# EAGLE design new_PowerBoard_V3 (EAGLE 5.11)
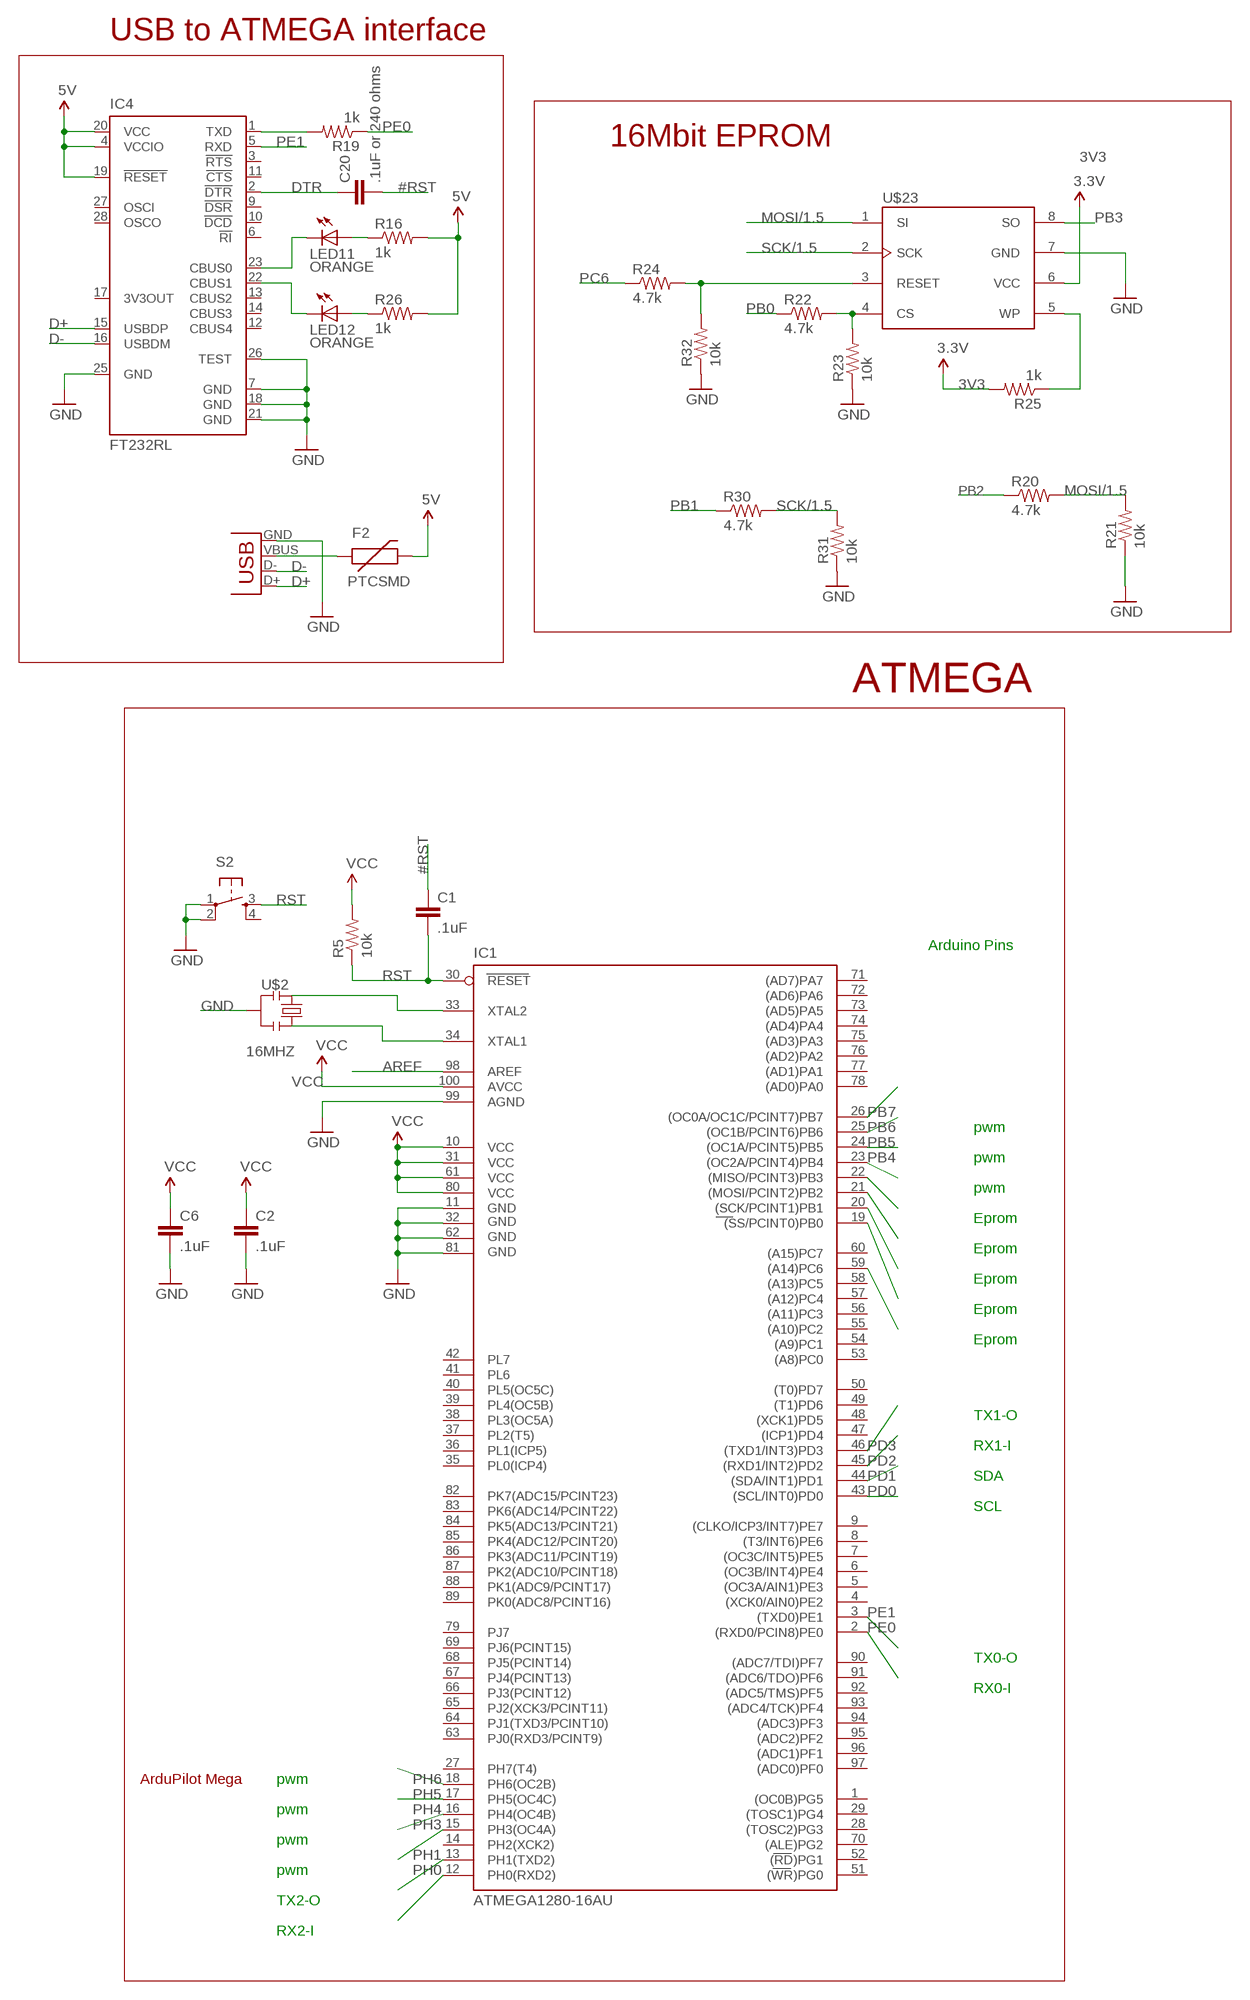
[diagram p0: schematic, sheet 1, part 1 of 2]
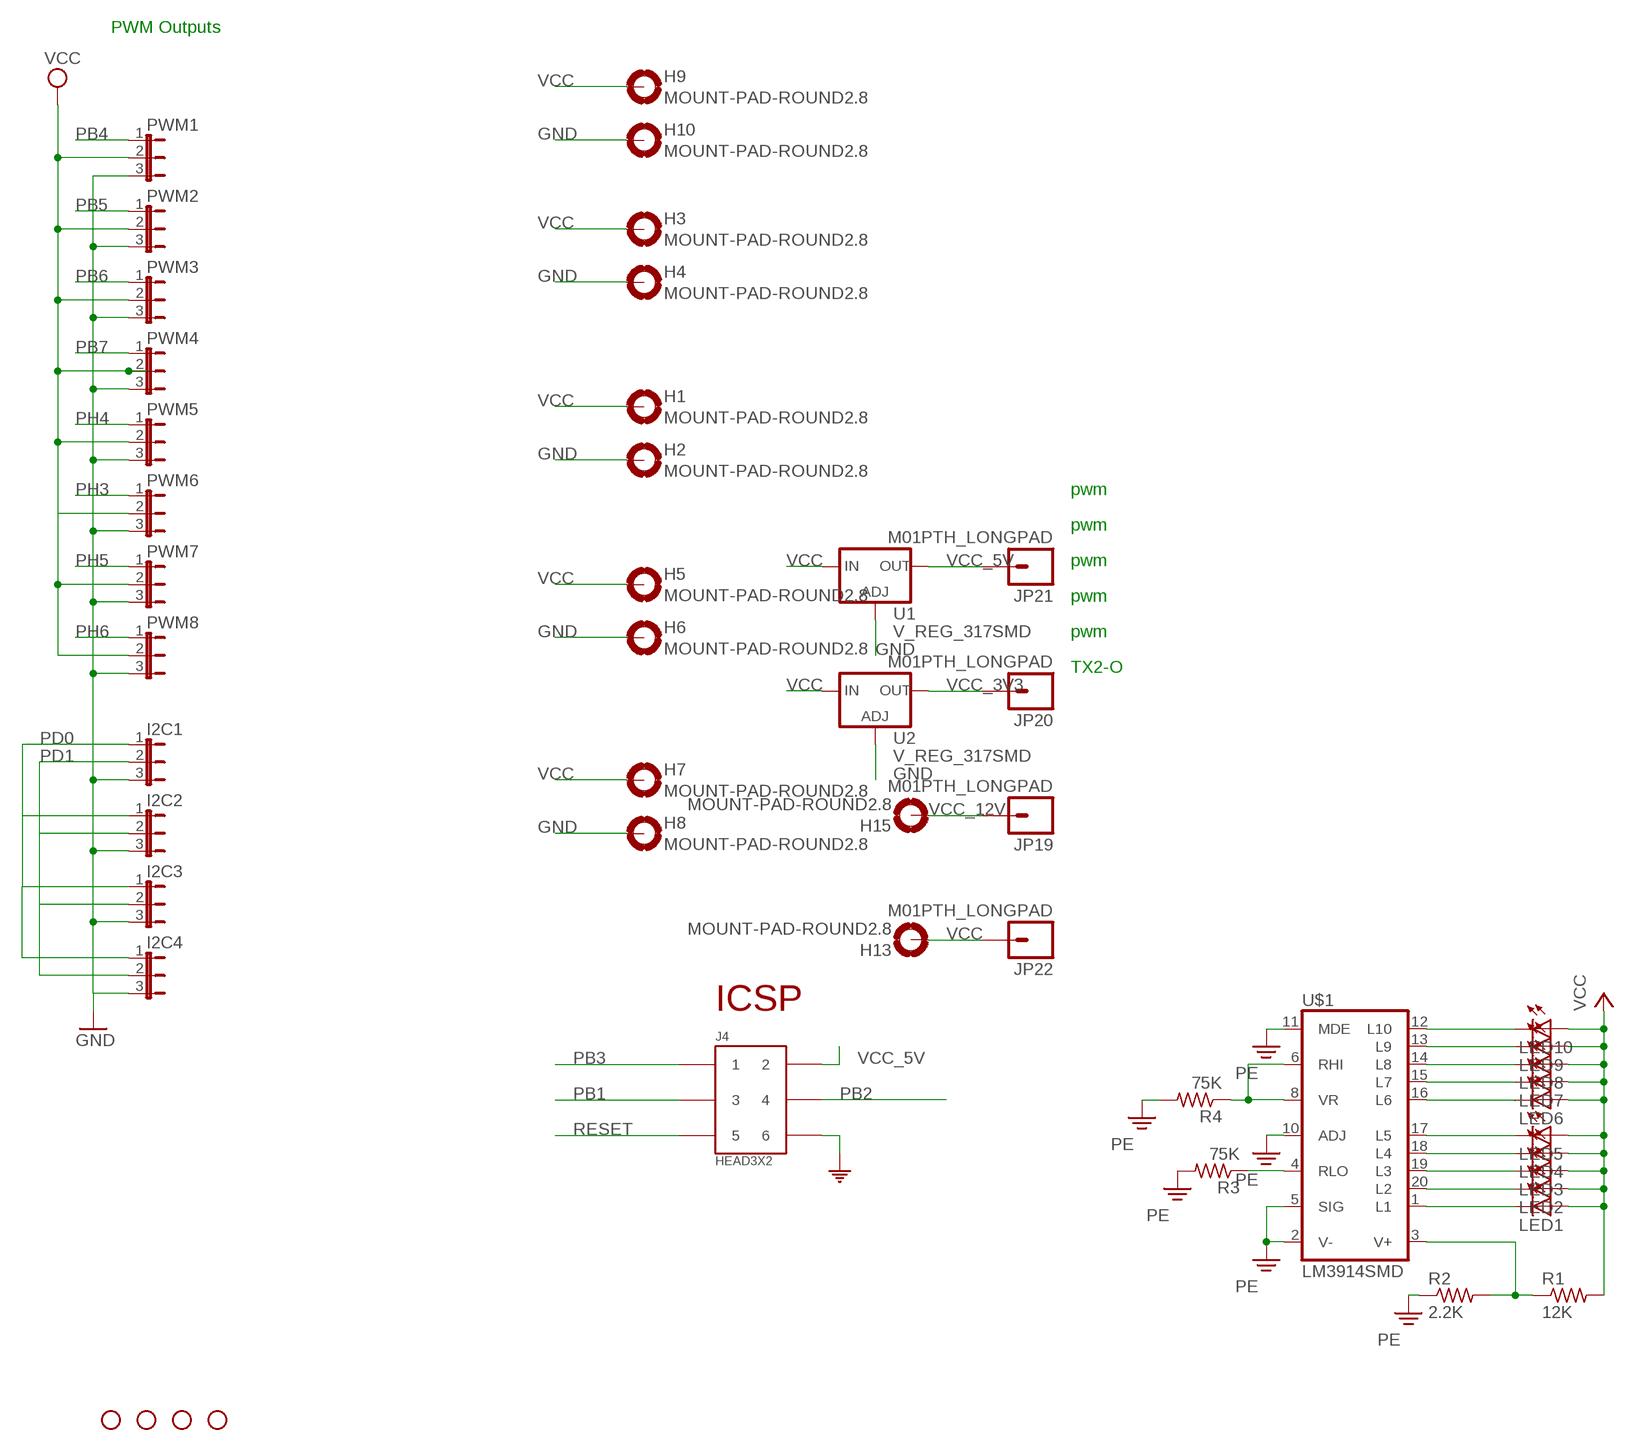
[diagram p1: schematic, sheet 1, part 2 of 2]

## Parts
C1  .1uF  CAP0402  [C0402]
C2  .1uF  CAP0402  [C0402]
C6  .1uF  CAP0402  [C0402]
C20  .1uF or 240 ohms  CAP0402  [C0402]
F2  PTCSMD  [PTC-1206]
H1  MOUNT-PAD-ROUND2.8  [2,8-PAD]
H2  MOUNT-PAD-ROUND2.8  [2,8-PAD]
H3  MOUNT-PAD-ROUND2.8  [2,8-PAD]
H4  MOUNT-PAD-ROUND2.8  [2,8-PAD]
H5  MOUNT-PAD-ROUND2.8  [2,8-PAD]
H6  MOUNT-PAD-ROUND2.8  [2,8-PAD]
H7  MOUNT-PAD-ROUND2.8  [2,8-PAD]
H8  MOUNT-PAD-ROUND2.8  [2,8-PAD]
H9  MOUNT-PAD-ROUND2.8  [2,8-PAD]
H10  MOUNT-PAD-ROUND2.8  [2,8-PAD]
H13  MOUNT-PAD-ROUND2.8  [2,8-PAD]
H15  MOUNT-PAD-ROUND2.8  [2,8-PAD]
I2C1  JP2E  [JP2]
I2C2  JP2E  [JP2]
I2C3  JP2E  [JP2]
I2C4  JP2E  [JP2]
IC1  ATMEGA1280-16AU  [TQFP100]
IC4  FT232RL  [SSOP28]
J4  HEAD3X2  [HEAD3X2]
JP12  STAND-OFF  [STAND-OFF]
JP13  STAND-OFF  [STAND-OFF]
JP14  STAND-OFF  [STAND-OFF]
JP15  STAND-OFF  [STAND-OFF]
JP19  M01PTH_LONGPAD  [1X01_LONGPAD]
JP20  M01PTH_LONGPAD  [1X01_LONGPAD]
JP21  M01PTH_LONGPAD  [1X01_LONGPAD]
JP22  M01PTH_LONGPAD  [1X01_LONGPAD]
LED1  LEDSMT1206  [1206]
LED2  LEDSMT1206  [1206]
LED3  LEDSMT1206  [1206]
LED4  LEDSMT1206  [1206]
LED5  LEDSMT1206  [1206]
LED6  LEDSMT1206  [1206]
LED7  LEDSMT1206  [1206]
LED8  LEDSMT1206  [1206]
LED9  LEDSMT1206  [1206]
LED10  LEDSMT1206  [1206]
LED11  ORANGE  LED0603  [LED-0603]
LED12  ORANGE  LED0603  [LED-0603]
PWM1  JP2E  [JP2]
PWM2  JP2E  [JP2]
PWM3  JP2E  [JP2]
PWM4  JP2E  [JP2]
PWM5  JP2E  [JP2]
PWM6  JP2E  [JP2]
PWM7  JP2E  [JP2]
PWM8  JP2E  [JP2]
R1  12K  R-US_R0805  [R0805]
R2  2.2K  R-US_R0805  [R0805]
R3  75K  R-US_R0805  [R0805]
R4  75K  R-US_R0805  [R0805]
R5  10k  RESISTOR0402  [C0402]
R16  1k  RESISTOR0402  [C0402]
R19  1k  RESISTOR0402  [C0402]
R20  4.7k  RESISTOR0402  [C0402]
R21  10k  RESISTOR0402  [C0402]
R22  4.7k  RESISTOR0402  [C0402]
R23  10k  RESISTOR0402  [C0402]
R24  4.7k  RESISTOR0402  [C0402]
R25  1k  RESISTOR0402  [C0402]
R26  1k  RESISTOR0402  [C0402]
R30  4.7k  RESISTOR0402  [C0402]
R31  10k  RESISTOR0402  [C0402]
R32  10k  RESISTOR0402  [C0402]
S2  TAC_SWITCHSMD  [TACTILE_SWITCH_SMD]
U1  V_REG_317SMD  [SOT223]
U2  V_REG_317SMD  [SOT223]
U$1  LM3914SMD  [PLCC20S]
U$2  16MHZ  RESONATORSMD  [RESONATOR-SMD]
U$23  DF  ATMEL_DATA_FLASH  [SO08WIDE]
X1  USBSMD  [USB-MINIB]

## Nets
3V3: R25.2 U$23.6(VCC) ; supply symbol labelled 3.3V
5V: F2.2
#RST: C1.1 C20.2
AREF: IC1.98(AREF)
D+: IC4.15(USBDP) X1.D+
D-: IC4.16(USBDM) X1.D-
DTR: C20.1 IC4.2(!DTR)
GND: C2.2 C6.2 H2.B2,8(MOUNT) H4.B2,8(MOUNT) H6.B2,8(MOUNT) H8.B2,8(MOUNT) H10.B2,8(MOUNT) I2C1.3 I2C2.3 I2C3.3 I2C4.3 IC1.11(GND) IC1.32(GND1) IC1.62(GND2) IC1.81(GND3) IC1.99(AGND) IC4.7(GND) IC4.18(GND) IC4.21(GND) IC4.25(GND) IC4.26(TEST) J4.6 PWM1.3 PWM2.3 PWM3.3 PWM4.3 PWM5.3 PWM6.3 PWM7.3 PWM8.3 R21.1 R23.1 R31.1 R32.1 S2.1 S2.2 U1.1(ADJ) U2.1(ADJ) U$2.2 U$23.7(GND) X1.GND ; supply symbol labelled COM
MOSI/1.5: R20.2 R21.2 U$23.1(SI)
N$1: R1.1 R2.2 U$1.3(V+)
N$2: LED10.C U$1.12(L10)
N$3: LED9.C U$1.13(L9)
N$4: LED8.C U$1.14(L8)
N$5: LED7.C U$1.15(L7)
N$7: LED6.C U$1.16(L6)
N$8: LED5.C U$1.17(L5)
N$9: LED4.C U$1.18(L4)
N$10: LED3.C U$1.19(L3)
N$11: LED2.C U$1.20(L2)
N$12: LED1.C U$1.1(L1)
N$14: R3.1 U$1.4(RLO)
N$15: R4.1 U$1.6(RHI) U$1.8(VR)
N$17: LED11.A R16.1
N$18: IC4.1(TXD) R19.2
N$19: R22.2 R23.2 U$23.4(CS)
N$20: R24.2 R32.2 U$23.3(RESET)
N$21: F2.1 X1.VBUS
N$22: LED12.A R26.1
N$24: IC4.23(CBUS0) LED11.C
N$25: IC4.22(CBUS1) LED12.C
N$56: IC1.34(XTAL1) U$2.3
N$89: IC1.33(XTAL2) U$2.1
PB0: IC1.19((SS/PCINT0)PB0) R22.1
PB1: IC1.20((SCK/PCINT1)PB1) J4.3 R30.1
PB2: IC1.21((MOSI/PCINT2)PB2) J4.4 R20.1
PB3: IC1.22((MISO/PCINT3)PB3) J4.1 U$23.8(SO)
PB4: IC1.23((OC2A/PCINT4)PB4) PWM1.1
PB5: IC1.24((OC1A/PCINT5)PB5) PWM2.1
PB6: IC1.25((OC1B/PCINT6)PB6) PWM3.1
PB7: IC1.26((OC0A/OC1C/PCINT7)PB7) PWM4.1
PC6: IC1.59((A14)PC6) R24.1
PD0: I2C1.1 I2C2.1 I2C3.1 I2C4.1 IC1.43((SCL/INT0)PD0)
PD1: I2C1.2 I2C2.2 I2C3.2 I2C4.2 IC1.44((SDA/INT1)PD1)
PD2: IC1.45((RXD1/INT2)PD2)
PD3: IC1.46((TXD1/INT3)PD3)
PE: R2.1 R3.2 R4.2 U$1.2(V-) U$1.5(SIG) U$1.10(ADJ) U$1.11(MDE)
PE0: IC1.2((RXD0/PCIN8)PE0) R19.1
PE1: IC1.3((TXD0)PE1) IC4.5(RXD)
PH0: IC1.12(PH0(RXD2))
PH1: IC1.13(PH1(TXD2))
PH3: IC1.15(PH3(OC4A)) PWM6.1
PH4: IC1.16(PH4(OC4B)) PWM5.1
PH5: IC1.17(PH5(OC4C)) PWM7.1
PH6: IC1.18(PH6(OC2B)) PWM8.1
RESET: J4.5
RST: C1.2 IC1.30(RESET) R5.1 S2.3
SCK/1.5: R30.2 R31.2 U$23.2(SCK)
VCC: C2.1 C6.1 H1.B2,8(MOUNT) H3.B2,8(MOUNT) H5.B2,8(MOUNT) H7.B2,8(MOUNT) H9.B2,8(MOUNT) H13.B2,8(MOUNT) IC1.10(VCC) IC1.31(VCC1) IC1.61(VCC2) IC1.80(VCC3) IC1.100(AVCC) IC4.4(VCCIO) IC4.19(!RESET) IC4.20(VCC) JP22.1 LED1.A LED2.A LED3.A LED4.A LED5.A LED6.A LED7.A LED8.A LED9.A LED10.A PWM7.2 PWM8.2 R1.2 R5.2 R16.2 R26.2 U1.3(IN) U2.3(IN) ; supply symbol labelled 5V
VCC_3V3: JP20.1 U2.2(OUT)
VCC_5V: J4.2 JP21.1 PWM1.2 PWM2.2 PWM3.2 PWM4.2 PWM5.2 PWM6.2 U1.2(OUT) ; supply symbol labelled VCC
VCC_12V: H15.B2,8(MOUNT) JP19.1
WP: R25.1 U$23.5(WP)
Unconnected: IC1.1((OC0B)PG5) IC1.4((XCK0/AIN0)PE2) IC1.5((OC3A/AIN1)PE3) IC1.6((OC3B/INT4)PE4) IC1.7((OC3C/INT5)PE5) IC1.8((T3/INT6)PE6) IC1.9((CLKO/ICP3/INT7)PE7) IC1.14(PH2(XCK2)) IC1.27(PH7(T4)) IC1.28((TOSC2)PG3) IC1.29((TOSC1)PG4) IC1.35(PL0(ICP4)) IC1.36(PL1(ICP5)) IC1.37(PL2(T5)) IC1.38(PL3(OC5A)) IC1.39(PL4(OC5B)) IC1.40(PL5(OC5C)) IC1.41(PL6) IC1.42(PL7) IC1.47((ICP1)PD4) IC1.48((XCK1)PD5) IC1.49((T1)PD6) IC1.50((T0)PD7) IC1.51((WR)PG0) IC1.52((RD)PG1) IC1.53((A8)PC0) IC1.54((A9)PC1) IC1.55((A10)PC2) IC1.56((A11)PC3) IC1.57((A12)PC4) IC1.58((A13)PC5) IC1.60((A15)PC7) IC1.63(PJ0(RXD3/PCINT9)) IC1.64(PJ1(TXD3/PCINT10)) IC1.65(PJ2(XCK3/PCINT11)) IC1.66(PJ3(PCINT12)) IC1.67(PJ4(PCINT13)) IC1.68(PJ5(PCINT14)) IC1.69(PJ6(PCINT15)) IC1.70((ALE)PG2) IC1.71((AD7)PA7) IC1.72((AD6)PA6) IC1.73((AD5)PA5) IC1.74((AD4)PA4) IC1.75((AD3)PA3) IC1.76((AD2)PA2) IC1.77((AD1)PA1) IC1.78((AD0)PA0) IC1.79(PJ7) IC1.82(PK7(ADC15/PCINT23)) IC1.83(PK6(ADC14/PCINT22)) IC1.84(PK5(ADC13/PCINT21)) IC1.85(PK4(ADC12/PCINT20)) IC1.86(PK3(ADC11/PCINT19)) IC1.87(PK2(ADC10/PCINT18)) IC1.88(PK1(ADC9/PCINT17)) IC1.89(PK0(ADC8/PCINT16)) IC1.90((ADC7/TDI)PF7) IC1.91((ADC6/TDO)PF6) IC1.92((ADC5/TMS)PF5) IC1.93((ADC4/TCK)PF4) IC1.94((ADC3)PF3) IC1.95((ADC2)PF2) IC1.96((ADC1)PF1) IC1.97((ADC0)PF0) IC4.3(!RTS) IC4.6(!RI) IC4.9(!DSR) IC4.10(!DCD) IC4.11(!CTS) IC4.12(CBUS4) IC4.13(CBUS2) IC4.14(CBUS3) IC4.17(3V3OUT) IC4.27(OSCI) IC4.28(OSCO) S2.4

## Notes on the sheet
- USB to ATMEGA interface
- 16Mbit EPROM
- PWM Outputs
- ATMEGA
- Arduino Pins
- pwm
- pwm
- pwm
- pwm
- pwm
- pwm
- TX2-O
- pwm
- pwm
- Eprom
- Eprom
- Eprom
- Eprom
- Eprom
- TX1-O
- ICSP
- RX1-I
- SDA
- SCL
- TX0-O
- RX0-I
- ArduPilot Mega | pwm
- pwm
- pwm
- pwm
- TX2-O
- RX2-I

## Library data of the parts
C1 C2 C6 C20 = DIYdrones3:CAP: Capacitor Standard 0603 ceramic capacitor, and 0.1" leaded capacitor.
F2 = DIYdrones3:PTC: Resettable Fuse PTC Resettable Fuse. Spark Fun Electronics SKU : COM-08357
H1-H10 H13 H15 = holes:MOUNT-PAD-ROUND: MOUNTING PAD, round
I2C1-I2C4 PWM1-PWM8 = jumper:JP2E: JUMPER
IC1 = atmel-2010:ATMEGA*: MICROCONTROLLER 64/128/256 Kbytes FLASH 4 Kbytes EEPROM 8 Kbytes SRAM 86 General Purpose I/O pins 12-channels16-bit PWM 4 x Serial USARTs 16-channels 10-bit A/D
IC4 = ftdichip:FT232R: Source: http://www.ftdichip.com/Documents/DataSheets/DS_FT232R_v104.pdf
J4 = MyCON2:HEAD3X2
JP12-JP15 = SparkFun:STAND-OFF: Stand Off This is the mechanical footprint for a #4 phillips button head screw. Use the keepout ring to avoid running the screw head into surrounding components. SKU : PRT-00447
JP19-JP22 = SparkFun:M01: Header 1 Standard 1-pin 0.1" header. Use with straight break away headers (SKU : PRT-00116), right angle break away headers (PRT-00553), swiss pins (PRT-00743), machine pins (PRT-00117), and female headers (PRT-00115).
LED1-LED10 = led:LED: LED OSRAM: - CHIPLED LG R971, LG N971, LY N971, LG Q971, LY Q971, LO R971, LY R971 LH N974, LH R974 LS Q976, LO Q976, LY Q976 LO Q996 - Hyper CHIPLED LW Q18S LB Q993, LB Q99A, LB R99A - SideLED LS A670, LO A670, LY A670, LG A670, LP A670 LB A673, LV A673, LT A673, LW A673 LH A674 LY A675 LS A676, LA A676, LO A676, LY A676, LW A676 LS A679, LY A679, LG A679 - Hyper Micro SIDELED® LS Y876, LA Y876, LO Y876, LY Y876 LT Y87S - SmartLED LW L88C, LW L88S LB L89C, LB L89S, LG L890 LS L89K, LO L89K, LY L89K LS L896, LA L896, LO L896, LY L896 - TOPLED LS T670, LO T670, LY T670, LG T670, LP T670 LSG T670, LSP T670, LSY T670, LOP T670, LYG T670 LG T671, LOG T671, LSG T671 LB T673, LV T673, LT T673, LW T673 LH T674 LS T676, LA T676, LO T676, LY T676, LB T676, LH T676, LSB T676, LW T676 LB T67C, LV T67C, LT T67C, LS T67K, LO T67K, LY T67K, LW E67C LS E67B, LA E67B, LO E67B, LY E67B, LB E67C, LV E67C, LT E67C LW T67C LS T679, LY T679, LG T679 LS T770, LO T770, LY T770, LG T770, LP T770 LB T773, LV T773, LT T773, LW T773 LH T774 LS E675, LA E675, LY E675, LS T675 LS T776, LA T776, LO T776, LY T776, LB T776 LHGB T686 LT T68C, LB T68C - Hyper Mini TOPLED® LB M676 - Mini TOPLED Santana® LG M470 LS M47K, LO M47K, LY M47K Source: http://www.osram.convergy.de LUXEON: - LUMILED® LXK2-PW12-R00, LXK2-PW12-S00, LXK2-PW14-U00, LXK2-PW14-V00 LXK2-PM12-R00, LXK2-PM12-S00, LXK2-PM14-U00 LXK2-PE12-Q00, LXK2-PE12-R00, LXK2-PE12-S00, LXK2-PE14-T00, LXK2-PE14-U00 LXK2-PB12-K00, LXK2-PB12-L00, LXK2-PB12-M00, LXK2-PB14-N00, LXK2-PB14-P00, LXK2-PB14-Q00 LXK2-PR12-L00, LXK2-PR12-M00, LXK2-PR14-Q00, LXK2-PR14-R00 LXK2-PD12-Q00, LXK2-PD12-R00, LXK2-PD12-S00 LXK2-PH12-R00, LXK2-PH12-S00 LXK2-PL12-P00, LXK2-PL12-Q00, LXK2-PL12-R00 Source: www.luxeon.com KINGBRIGHT: KA-3528ASYC Source: www.kingbright.com
LED11 LED12 = DIYdrones3:LED: LEDs Standard schematic elements and footprints for 5mm, 3mm, 1206, and 0603 sized LEDs. 5mm - Spark Fun Electronics SKU : COM-00529 (and others)
R1-R4 = resistor:R-US_: RESISTOR, American symbol
R5 R16 R19-R26 R30-R32 = DIYdrones3:RESISTOR: Resistor Basic schematic elements and footprints for 0603, 1206, and PTH 1/10th watt (small) resistors.
S2 = SparkFun:TAC_SWITCH: Momentary Switch Button commonly used for reset or general input. Spark Fun Electronics SKU : COM-00097
U1 U2 = SparkFun:V_REG_317: Voltage Regulator Standard LM317 adjustable voltage regulator. AOI (Adjust Output Input). Google 'LM317 Calculator' for easy to use app to get the two resistor values needed. 240/720 for 5V output. 240/390 for 3.3V output. Spark Fun Electronics SKU : COM-00527
U$1 = linear:LM3914SMD
U$2 = DIYdrones3:RESONATOR: Resonator Small SMD resonator. This is the itty bitty 10/20MHz resonators with built in caps. CSTCE10M0G55 and CSTCE20M0V53. Footprint has been reviewed closely but hasn't been tested yet.
U$23 = DIYdrones3:ATMEL_DATA_FLASH: 16Mbit EEPROM DataFlash Footprint needs touching up. Spark Fun Electronics SKU : COM-00301
X1 = DIYdrones3:USB: USB Connectors USB-B-PTH is fully proven SKU : PRT-00139 USB-miniB is fully proven SKU : PRT-00587 USB-A-PCB is untested. USB-A-H is throughly reviewed, but untested. Spark Fun Electronics SKU : PRT-00437 USB-B-SMT is throughly reviewed, but untested. Needs silkscreen touching up. USB-A-S has not been used/tested USB-MB-H has not been used/tested

## Board
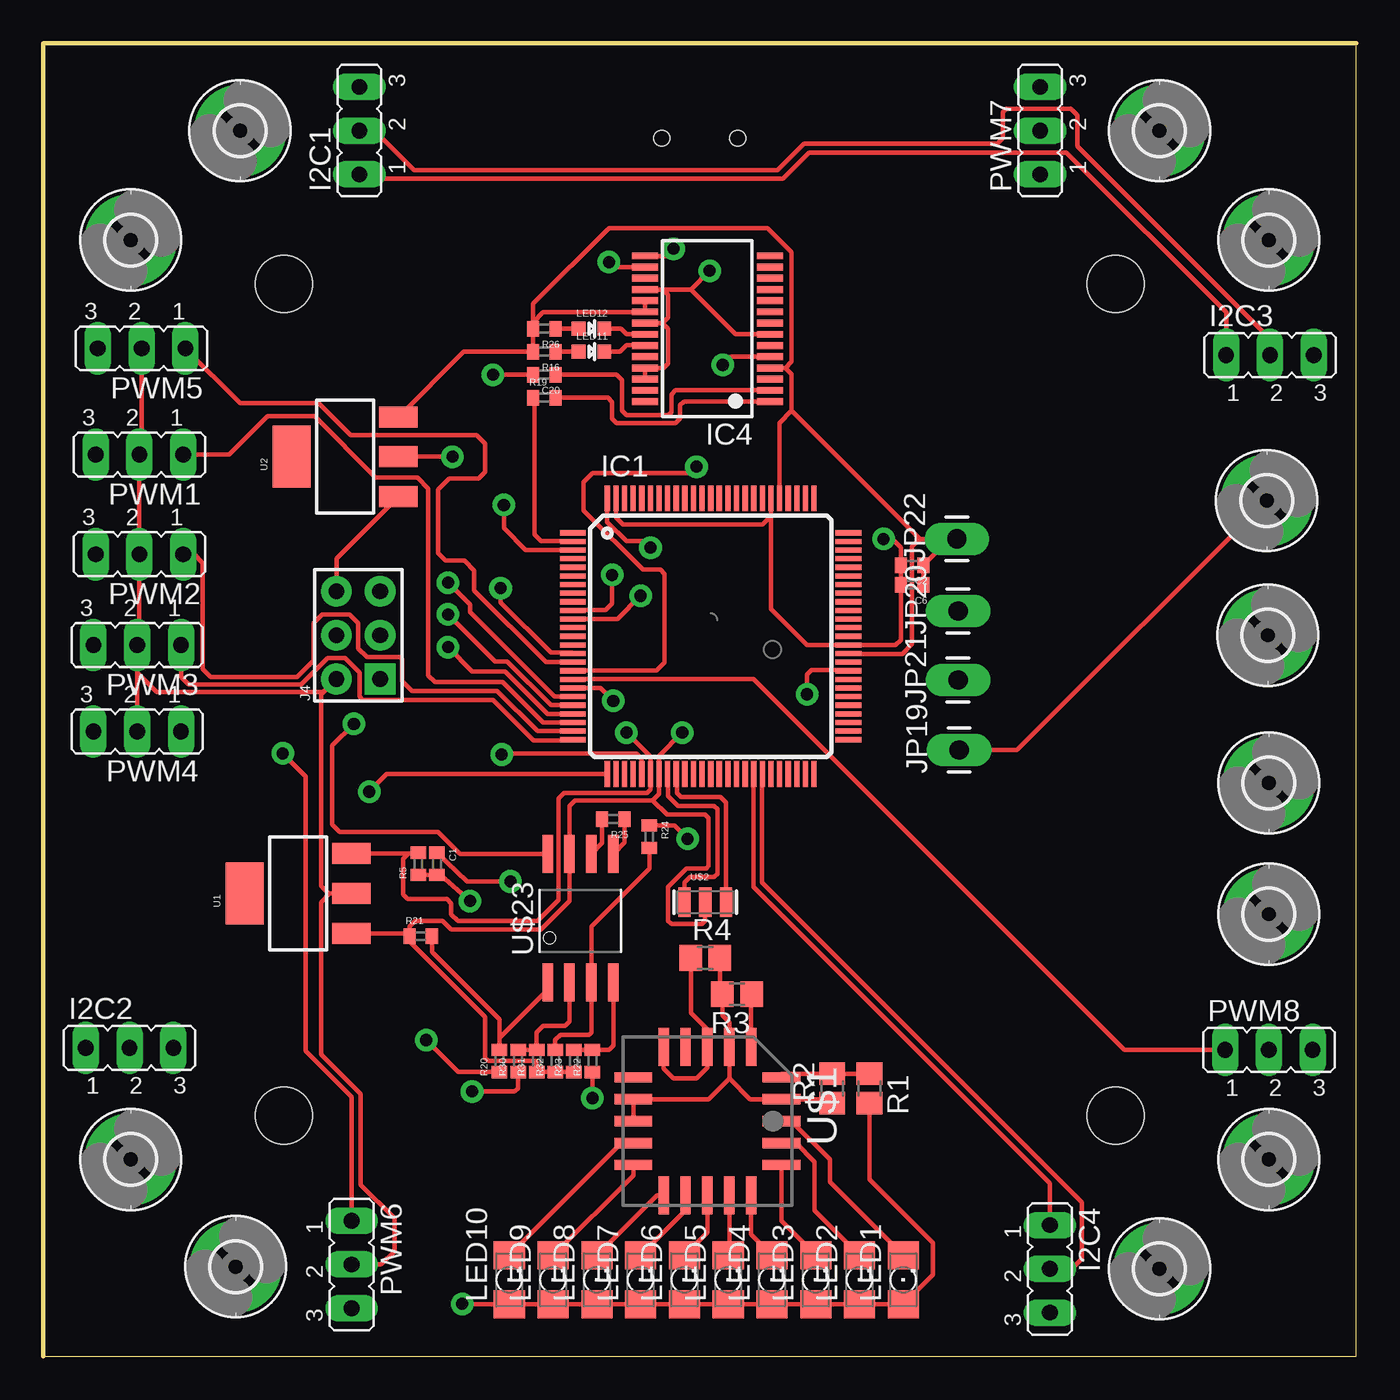
[diagram p2: board, top side]
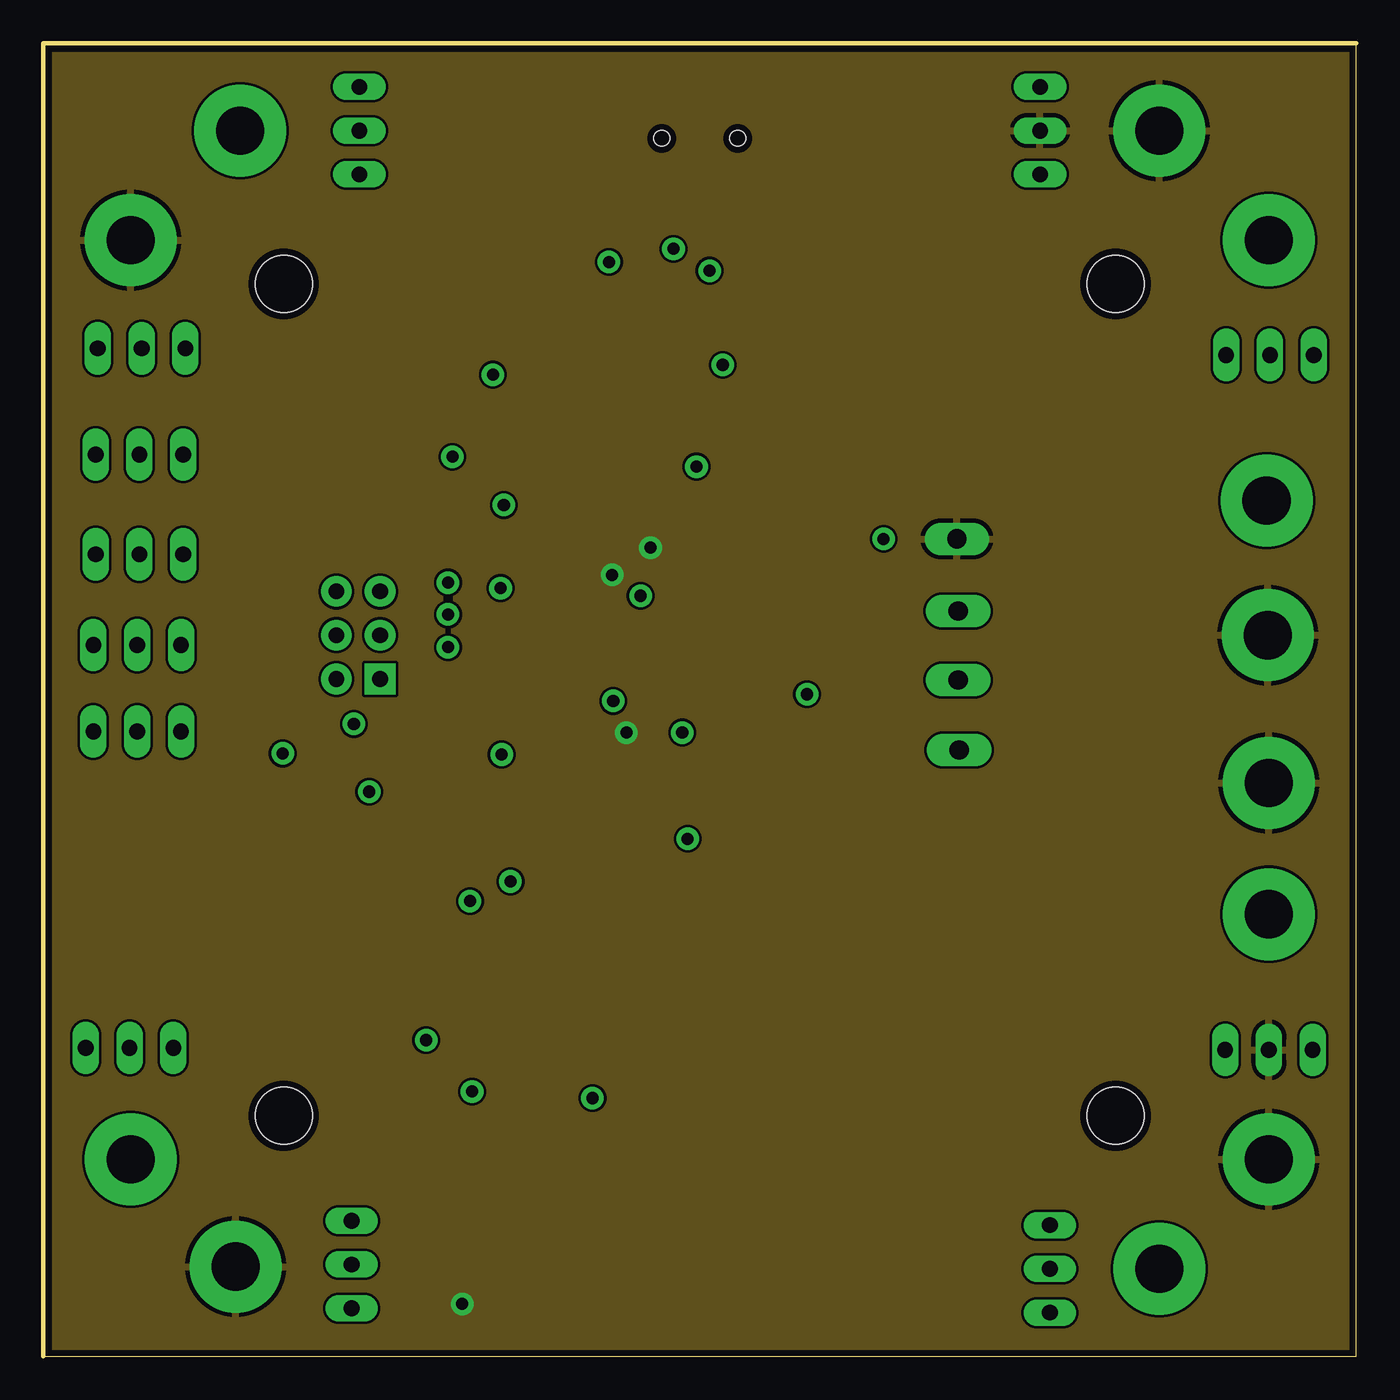
[diagram p3: board, inner layer VCC]
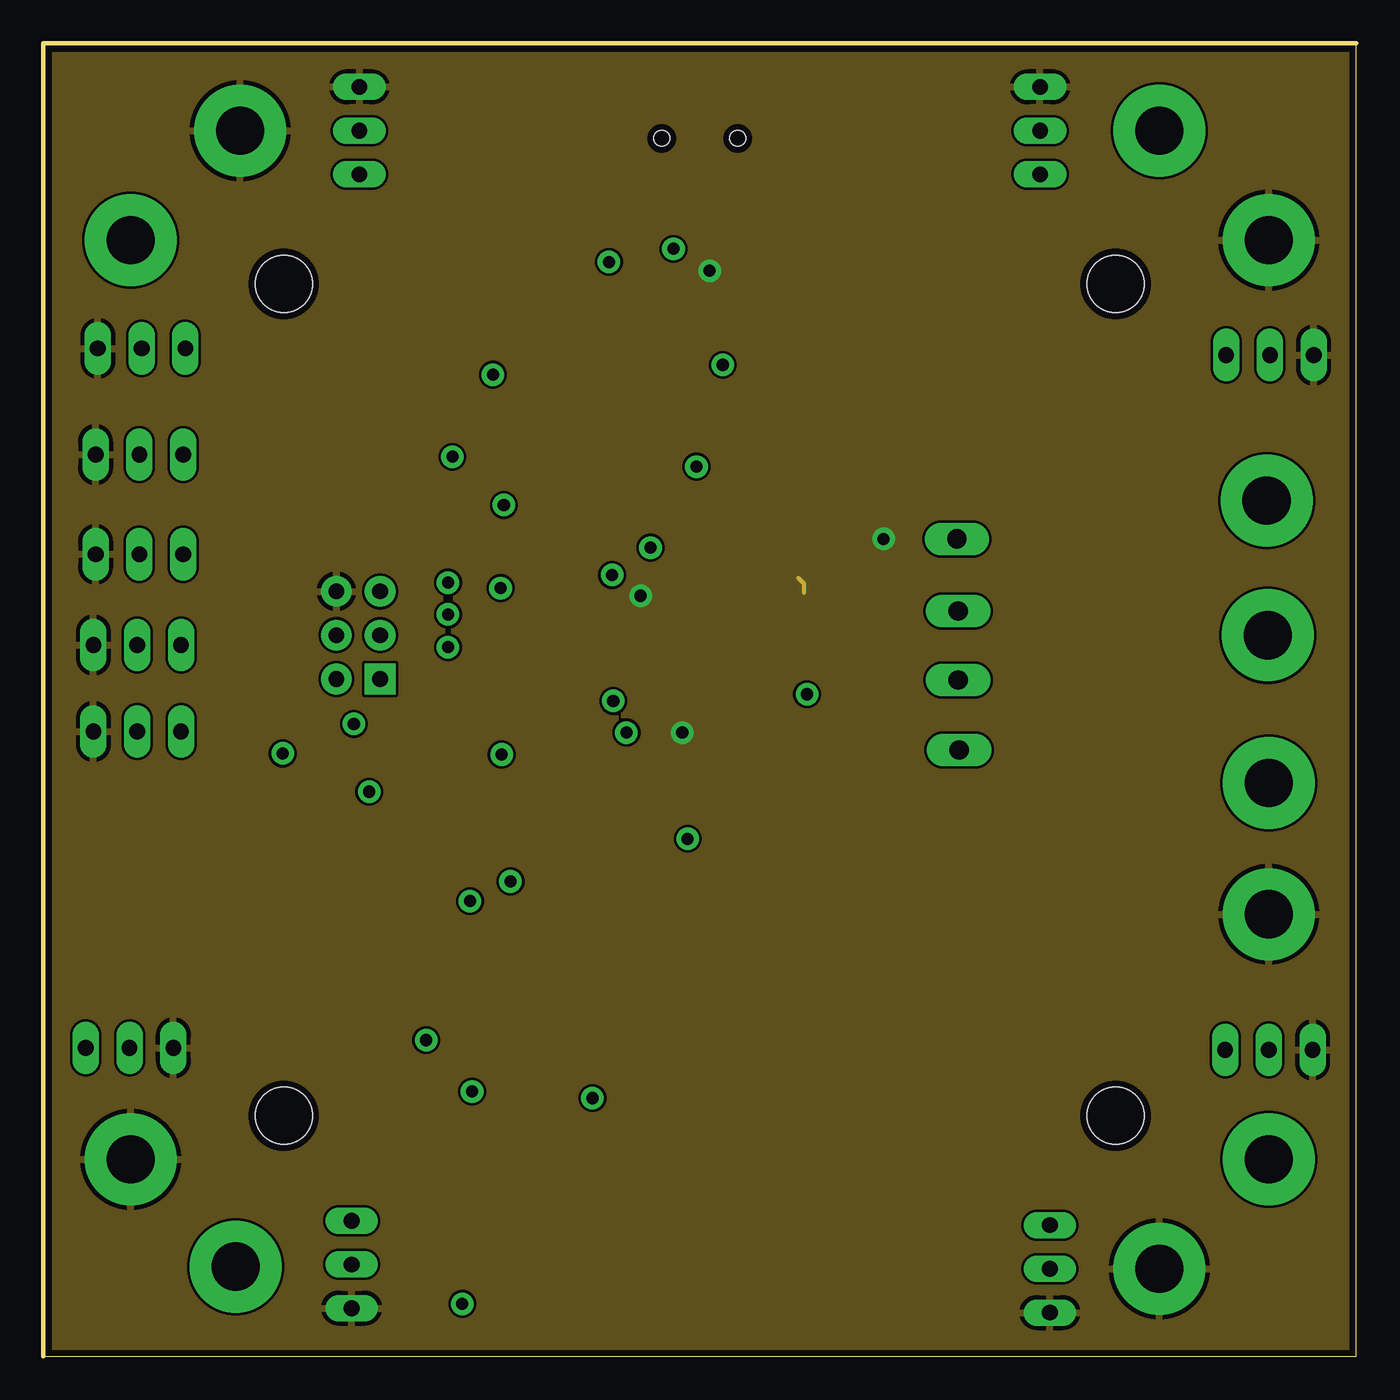
[diagram p4: board, inner layer GND]
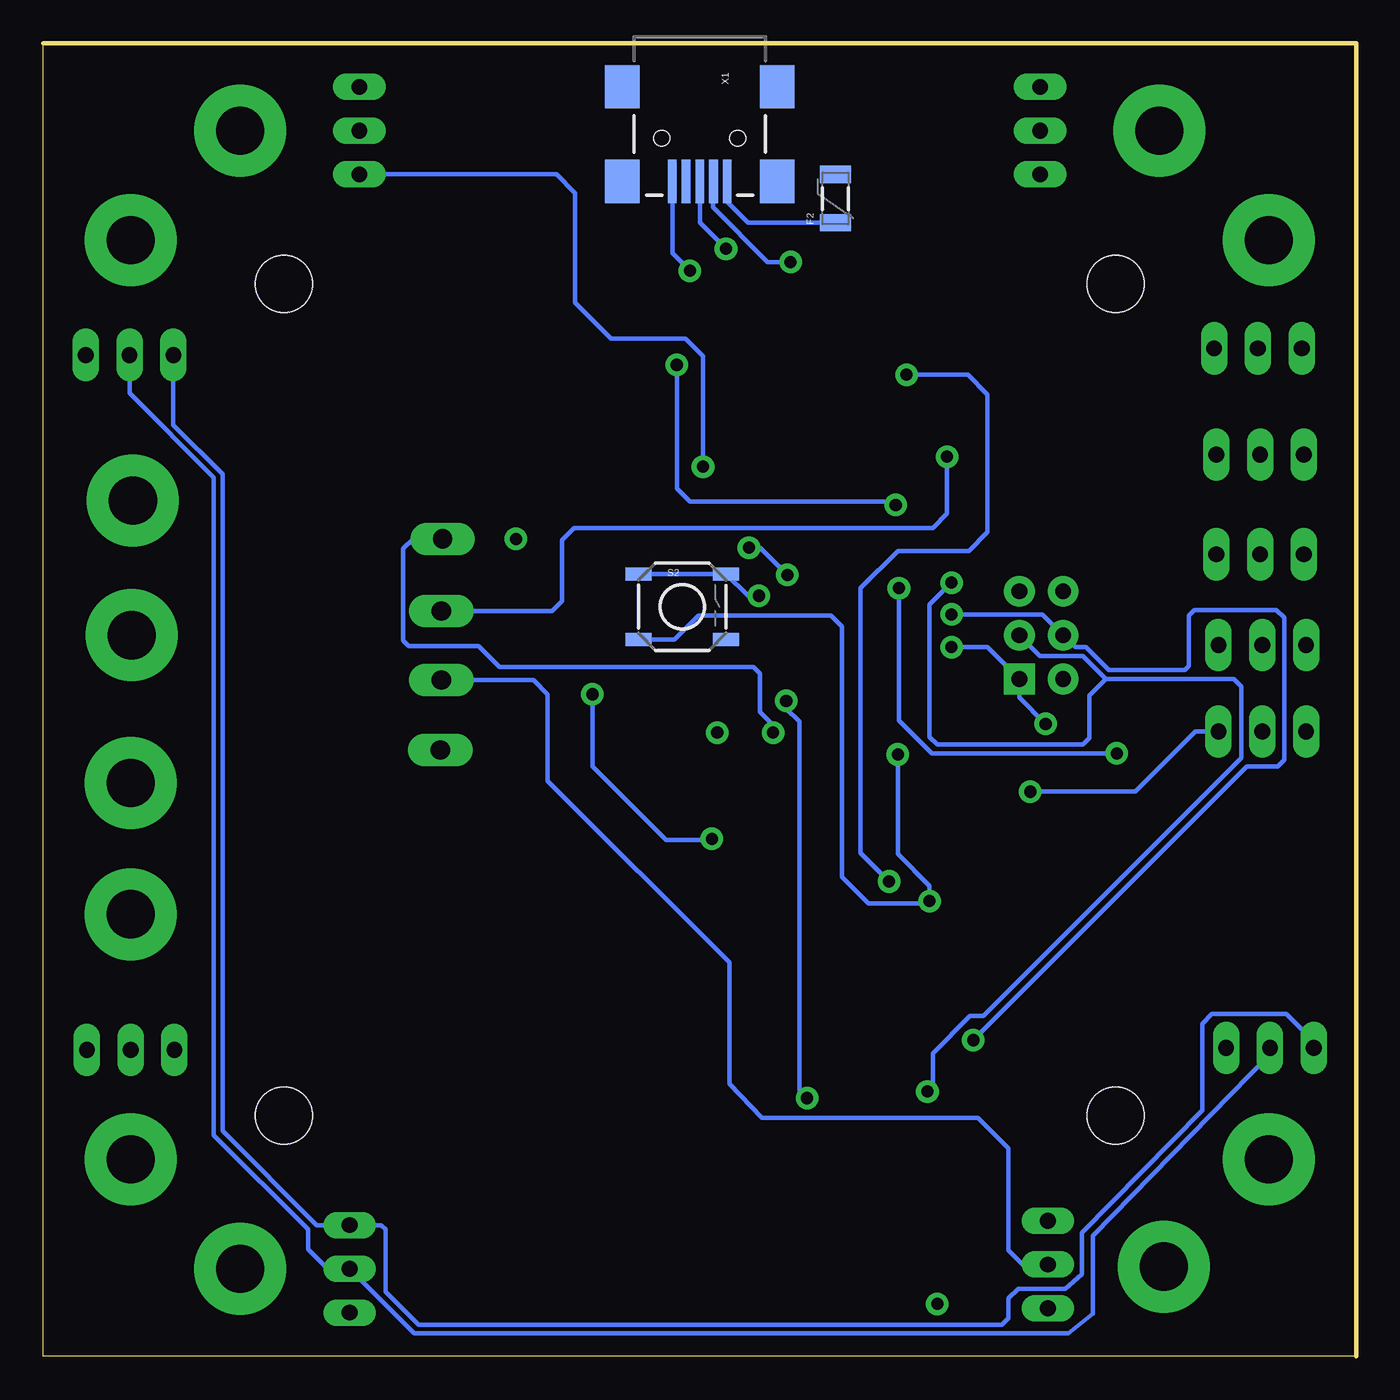
[diagram p5: board, bottom side, seen from below]

Size 76.2 x 76.2 mm. Coordinates in mm from the lower left corner, seen from the top.
Outline: 0,0 76.2,0 76.2,76.2 0,76.2 0,0
Copper layers (1*2*15*16): Top 0.0356mm / dielectric 1.5011mm / VCC 0.0356mm / dielectric 0.1499mm / GND 0.0356mm / dielectric 0.2007mm / Bottom 0.0356mm
Design rules "Aerial-4Layer": minimum track width 10mil, minimum drill 15mil, track to track 6mil, track to pad 6mil, pad to pad 6mil, via to via 12mil, smd to smd 6mil, copper to edge 15mil, drill to drill 8mil, minimum pad ring 12mil, minimum via ring 12mil, stop-mask expansion 4mil, vias tented up to drill 0mil, thermal gap 10mil

### Footprints (pad centres in the part's own frame; a part is rotated, then mirrored left to right if it is on the bottom)
C0402 = smd 0.7 x 0.9: 1 -0.65,0; 2 0.65,0
PTC-1206 = smd 1 x 1.8: 1 -1.4,0; 2 1.4,0
2,8-PAD = drill 2.8 pad 5.334 round: B2,8 0,0
JP2 = drill 0.914 long: 1 -2.54,0; 2 0,0; 3 2.54,0
TQFP100 = smd 1.5 x 0.3: 1 -8,6; 2 -8,5.5; 3 -8,5; 4 -8,4.5; 5 -8,4; 6 -8,3.5; 7 -8,3; 8 -8,2.5; 9 -8,2; 10 -8,1.5; 11 -8,1; 12 -8,0.5; 13 -8,0; 14 -8,-0.5; 15 -8,-1; 16 -8,-1.5; 17 -8,-2; 18 -8,-2.5; 19 -8,-3; 20 -8,-3.5; 21 -8,-4; 22 -8,-4.5; 23 -8,-5; 24 -8,-5.5; 25 -8,-6; 51 8,-6; 52 8,-5.5; 53 8,-5; 54 8,-4.5; 55 8,-4; 56 8,-3.5; 57 8,-3; 58 8,-2.5; 59 8,-2; 60 8,-1.5; 61 8,-1; 62 8,-0.5; 63 8,0; 64 8,0.5; 65 8,1; 66 8,1.5; 67 8,2; 68 8,2.5; 69 8,3; 70 8,3.5; 71 8,4; 72 8,4.5; 73 8,5; 74 8,5.5; 75 8,6 | smd 0.3 x 1.5: 26 -6,-8; 27 -5.5,-8; 28 -5,-8; 29 -4.5,-8; 30 -4,-8; 31 -3.5,-8; 32 -3,-8; 33 -2.5,-8; 34 -2,-8; 35 -1.5,-8; 36 -1,-8; 37 -0.5,-8; 38 0,-8; 39 0.5,-8; 40 1,-8; 41 1.5,-8; 42 2,-8; 43 2.5,-8; 44 3,-8; 45 3.5,-8; 46 4,-8; 47 4.5,-8; 48 5,-8; 49 5.5,-8; 50 6,-8; 76 6,8; 77 5.5,8; 78 5,8; 79 4.5,8; 80 4,8; 81 3.5,8; 82 3,8; 83 2.5,8; 84 2,8; 85 1.5,8; 86 1,8; 87 0.5,8; 88 0,8; 89 -0.5,8; 90 -1,8; 91 -1.5,8; 92 -2,8; 93 -2.5,8; 94 -3,8; 95 -3.5,8; 96 -4,8; 97 -4.5,8; 98 -5,8; 99 -5.5,8; 100 -6,8
SSOP28 = smd 0.4 x 1.5: 1 -4.225,-3.625; 2 -3.575,-3.625; 3 -2.925,-3.625; 4 -2.275,-3.625; 5 -1.625,-3.625; 6 -0.975,-3.625; 7 -0.325,-3.625; 8 0.325,-3.625; 9 0.975,-3.625; 10 1.625,-3.625; 11 2.275,-3.625; 12 2.925,-3.625; 13 3.575,-3.625; 14 4.225,-3.625; 15 4.225,3.625; 16 3.575,3.625; 17 2.925,3.625; 18 2.275,3.625; 19 1.625,3.625; 20 0.975,3.625; 21 0.325,3.625; 22 -0.325,3.625; 23 -0.975,3.625; 24 -1.625,3.625; 25 -2.275,3.625; 26 -2.925,3.625; 27 -3.575,3.625; 28 -4.225,3.625
HEAD3X2 = drill 0.914 pad 1.778 square: 1 0,0 | drill 0.914 pad 1.778 round: 2 0,2.54; 3 2.54,0; 4 2.54,2.54; 5 5.08,0; 6 5.08,2.54
STAND-OFF = hole 3.302: 0,0
1X01_LONGPAD = drill 1.118 pad 1.88 long: 1 0,0
1206 = smd 1.6 x 1.803: A -1.422,0; C 1.422,0
LED-0603 = smd 0.8 x 0.8: A 0,-0.75; C 0,0.75
R0805 = smd 1.3 x 1.5: 1 -0.85,0; 2 0.85,0
TACTILE_SWITCH_SMD = smd 1.524 x 0.762: 1 -2.54,1.905; 2 2.54,1.905; 3 -2.54,-1.905; 4 2.54,-1.905
SOT223 = smd 1.219 x 2.235: 1 -2.311,-3.099; 2 0,-3.099; 3 2.311,-3.099 | smd 3.6 x 2.2: 4 0,3.099
PLCC20S = smd 0.6 x 2.2: 1 0,4.3; 2 -1.27,4.3; 3 -2.54,4.3; 9 -2.54,-4.3; 10 -1.27,-4.3; 11 0,-4.3; 12 1.27,-4.3; 13 2.54,-4.3; 19 2.54,4.3; 20 1.27,4.3 | smd 2.2 x 0.6: 4 -4.3,2.54; 5 -4.3,1.27; 6 -4.3,0; 7 -4.3,-1.27; 8 -4.3,-2.54; 14 4.3,-2.54; 15 4.3,-1.27; 16 4.3,0; 17 4.3,1.27; 18 4.3,2.54
RESONATOR-SMD = smd 0.7 x 1.7: 1 -1.2,0; 2 0,0; 3 1.2,0
SO08WIDE = smd 0.61 x 2.21: 1 -1.905,-3.569; 2 -0.635,-3.569; 3 0.635,-3.569; 4 1.905,-3.569; 5 1.905,3.886; 6 0.635,3.886; 7 -0.635,3.886; 8 -1.905,3.886
USB-MINIB = smd 2.5 x 0.5: D+ 2.5,0; D- 2.5,0.8; GND 2.5,-1.6; ID 2.5,-0.8; VBUS 2.5,1.6 | smd 2.5 x 2: GND@1 -3,-4.5; GND@2 -3,4.5; GND@3 2.5,4.5; GND@4 2.5,-4.5 | hole 0.9: 0,2.2; 0,-2.2

### Placement (x,y rotation side)
C1  22.86,28.57 270 top
C2  50.42,45.91 180 top
C6  50.42,44.77 180 top
C20  29.08,56.96 180 top
F2  30.23,67.18 90 bottom
H1  71.12,33.27 0 top
H2  71.12,25.65 0 top
H3  71.12,11.43 0 top
H4  64.77,5.08 0 top
H5  64.77,71.12 0 top
H6  71.12,64.77 0 top
H7  5.08,64.77 0 top
H8  11.43,71.12 0 top
H9  11.18,5.21 0 top
H10  5.08,11.43 0 top
H13  71.06,41.85 0 top
H15  70.99,49.66 0 top
I2C1  18.35,71.12 90 top
I2C2  5.02,17.91 0 top
I2C3  71.18,58.1 0 top
I2C4  58.42,5.08 270 top
IC1  38.73,41.78 0 top
IC4  38.54,59.63 90 top
J4  19.56,39.31 90 top
JP12  62.23,13.97 0 top
JP13  13.97,13.97 0 top
JP14  62.23,62.23 0 top
JP15  13.97,62.23 0 top
JP19  53.15,35.18 90 top
JP20  53.09,43.24 90 top
JP21  53.09,39.24 90 top
JP22  53.02,47.43 90 top
LED1  49.91,4.45 90 top
LED2  47.37,4.45 90 top
LED3  44.83,4.45 90 top
LED4  42.29,4.45 90 top
LED5  39.75,4.45 90 top
LED6  37.21,4.45 90 top
LED7  34.67,4.45 90 top
LED8  32.13,4.45 90 top
LED9  29.59,4.45 90 top
LED10  27.05,4.45 90 top
LED11  31.81,58.29 270 top
LED12  31.81,59.63 270 top
PWM1  5.59,52.32 180 top
PWM2  5.59,46.55 180 top
PWM3  5.46,41.27 180 top
PWM4  5.46,36.26 180 top
PWM5  5.71,58.48 180 top
PWM6  17.91,5.33 270 top
PWM7  57.85,71.12 90 top
PWM8  71.12,17.78 0 top
R1  47.94,15.56 270 top
R2  45.78,15.56 90 top
R3  40.26,21.02 180 top
R4  38.42,23.11 0 top
R5  21.78,28.57 90 top
R16  29.08,58.29 180 top
R19  29.08,55.63 0 top
R20  26.48,17.14 90 top
R21  21.91,24.38 0 top
R22  31.88,17.14 90 top
R23  30.8,17.14 90 top
R24  35.18,30.16 270 top
R25  33.08,31.18 180 top
R26  29.08,59.63 180 top
R30  27.56,17.14 90 top
R31  28.64,17.14 90 top
R32  29.72,17.14 90 top
S2  39.12,43.5 0 bottom
U1  14.8,26.86 90 top
U2  17.53,52.2 90 top
U$1  38.54,13.65 270 top
U$2  38.42,26.35 0 top
U$23  31.18,25.27 0 top
X1  38.1,70.68 270 bottom

### Tracks (layer width: path | path; a pad name or v marks a point on that pad's centre or on a via)
3V3
  Top 0.254: R25.2 32.43,29.78 U$23.6
#RST  (via drill 0.7)
  Top 0.254: v27.11,27.56 24.59,27.56 C1.1 | v26.1,56.96 C20.2
  Bottom 0.254: v27.11,27.56 28.77,29.21 28.77,44.58 26.61,46.74 22.48,46.74 21.4,47.82 21.4,55.82 22.54,56.96 v26.1,56.96
D+  (via drill 0.7)
  Top 0.254: IC4.15 36.17,63.85 v36.58,64.26
  Bottom 0.254: v36.58,64.26 38.1,65.79 X1.D+
D-  (via drill 0.7)
  Top 0.254: IC4.16 33.13,63.2 v32.83,63.5
  Bottom 0.254: v32.83,63.5 34.16,63.5 37.34,66.67 37.34,68.14 X1.D-
DTR
  Top 0.254: IC4.2 42.15,56.07 36.7,56.07 36.45,55.82 36.45,54.8 36.26,54.61 33.85,54.61 33.59,54.86 33.59,56.64 33.27,56.96 C20.1
GND  (via drill 0.7)
  Top 0.254: 35.95,61.9 IC4.18 | 35.95,61.9 36.26,61.59 36.26,60.26 35.94,59.94 IC4.21 35.93,59.95 36.26,59.63 36.26,57.59 36.01,57.34 IC4.25 IC4.26 | 35.95,61.9 37.58,61.9 | 37.58,61.9 v38.67,62.99 | IC4.7 40.18,59.3 37.58,61.9 | J4.6 17.02,46.28 U2.1 | IC1.32 35.75,33.7 35.75,32.64 35.37,32.26 | 35.37,32.26 30.86,32.26 30.54,31.94 U$23.7 30.54,26.42 28.89,24.77 23.69,24.77 23.18,25.27 21.59,25.27 21.27,24.96 21.27,24.4 R21.1 | IC1.32 35.75,33.8 | 44.32,41.27 44.33,41.28 IC1.62 46.74,41.27 | 42.23,48.77 42.23,43.36 44.32,41.27 | 42.23,48.77 IC1.81 | C2.2 C6.2 49.77,41.58 | 46.74,41.27 49.47,41.27 49.77,41.58 | IC1.11 33.32,42.78 v34.67,44.13 | IC1.99 33.23,48.68 33.66,48.26 41.73,48.26 42.23,48.77 | R23.1 R32.1 R31.1 28.64,17.08 28.57,17.14 25.84,17.14 25.65,17.34 25.65,19.68 21.26,24.08 R21.1 | U1.1 21.09,24.55 R21.1 | U$2.2 38.42,25.27 38.23,25.08 36.45,25.08 36.26,25.27 36.26,27.24 37.34,28.32 38.48,28.32 38.61,28.45 38.61,31.24 38.42,31.43 36.2,31.43 35.37,32.26 | IC1.32 35.73,34.85 v37.08,36.2 | 44.32,41.27 46.74,41.27 | 49.77,41.58 49.78,41.59 49.78,46.93 49.28,47.43 v48.77,47.43
  GND 0.254: v37.08,36.2 37.15,36.2 | 44.13,44.32 44.13,44.83 43.81,45.15 | v48.77,47.43 48.7,47.43
  Bottom 0.254: v38.67,62.99 39.69,64.01 39.69,68.16 X1.GND | S2.2 S2.1 | S2.2 36.53,45.45 | v34.67,44.13 35.31,44.13 S2.2
  pour GND: -0.44,76.9 77.34,76.9 77.34,-1.21 -0.44,-1.21
MOSI/1.5
  Top 0.254: 26.48,18.48 R20.2 | R21.2 22.56,23.48 26.48,19.56 26.48,18.48 | 26.48,18.48 29.27,21.27 U$23.1
N$1
  Top 0.254: R1.1 R2.2 42.84,16.41 U$1.3
N$2
  Top 0.254: U$1.12 33.57,12.38 LED10.C
N$3
  Top 0.254: U$1.13 34.24,10.52 LED9.C
N$4
  Top 0.254: U$1.14 35.62,9.35 LED8.C
N$5
  Top 0.254: U$1.15 37.27,8.47 LED7.C
N$7
  Top 0.254: U$1.16 38.54,7.2 LED6.C
N$8
  Top 0.254: U$1.17 39.81,5.93 LED5.C
N$9
  Top 0.254: U$1.18 41.08,7.07 LED4.C
N$10
  Top 0.254: U$1.19 42.84,7.85 LED3.C
N$11
  Top 0.254: U$1.20 43.69,12.38 44.77,11.3 44.77,8.47 LED2.C
N$12
  Top 0.254: U$1.1 43.43,13.65 45.66,11.43 45.66,10.12 LED1.C
N$14
  Top 0.254: U$1.4 41.08,20.99 R3.1
N$15
  Top 0.254: U$1.8 36.01,16.7 36.58,16.13 37.91,16.13 38.54,16.76 U$1.6 38.54,18.99 37.59,19.94 37.59,23.09 R4.1
N$17
  Top 0.254: R16.1 LED11.A
N$18
  Top 0.254: IC4.1 37.18,55.4 36.96,55.18 36.96,54.42 36.7,54.17 33.27,54.17 33.02,54.42 33.02,55.37 32.77,55.63 R19.2
N$19
  Top 0.254: R23.2 R22.2 32.84,17.8 33.08,18.03 U$23.4
N$20
  Top 0.254: R24.2 35.18,28.32 31.81,24.96 U$23.3 31.81,18.8 31.69,18.67 30.04,18.67 29.72,18.35 R32.2
N$21
  Bottom 0.254: F2.1 35.3,65.78 36.45,66.93 36.45,68.12 X1.VBUS
N$22
  Top 0.254: R26.1 LED12.A
N$24
  Top 0.254: LED11.C 33.47,58.29 33.85,58.67 34.9,58.67 IC4.23
N$25
  Top 0.254: LED12.C 33.53,59.63 33.85,59.31 IC4.22
N$56
  Top 0.254: 36.7,33.81 IC1.34 36.77,33.75 36.77,32.7 37.02,32.45 39.31,32.45 39.62,32.14 U$2.3
N$89
  Top 0.254: U$2.1 37.22,27.5 37.53,27.81 38.92,27.81 39.12,28 39.12,31.75 38.92,31.94 36.83,31.94 36.26,32.51 36.26,33.76 IC1.33
PB0  (via drill 0.7)
  Top 0.254: IC1.19 32.34,38.78 v33.08,38.04 | v31.88,14.99 R22.1
  Bottom 0.254: v33.08,38.04 33.08,37.59 32.32,36.83 32.32,15.43 v31.88,14.99
PB1  (via drill 0.7)
  Top 0.254: v24.89,15.37 27.37,15.37 27.56,15.56 R30.1 | IC1.20 29.66,38.28 24.77,43.18 24.77,43.62 v23.5,44.9
  Bottom 0.254: 14.54,39.31 7.11,39.31 6.67,38.86 6.67,34.73 21.65,19.75 22.42,19.75 24.57,17.59 24.57,15.68 v24.89,15.37 | 14.54,39.31 15.88,40.64 18.35,40.64 J4.3 | v23.5,44.9 24.77,43.62 24.77,35.94 24.32,35.5 15.88,35.5 15.49,35.88 15.49,38.35 14.54,39.31
PB2  (via drill 0.7)
  Top 0.254: IC1.21 29.46,37.78 26.92,40.32 26.23,40.32 v23.5,43.05 | v22.23,18.35 24.08,16.5 R20.1
  Bottom 0.254: v23.5,43.05 18.22,43.05 J4.4 16.32,41.15 15.68,41.15 14.35,39.81 9.97,39.81 9.72,40.07 9.72,42.99 9.4,43.31 4.64,43.31 4.19,42.86 4.19,34.61 4.57,34.23 6.35,34.23 v22.23,18.35
PB3  (via drill 0.7)
  Top 0.254: IC1.22 29.27,37.28 26.8,39.75 24.89,39.75 v23.5,41.15 | U$23.8 24.18,29.16 22.92,30.42 17.21,30.42 16.76,30.86 16.76,35.43 v18.03,36.7
  Bottom 0.254: v23.5,41.15 21.4,41.15 J4.1 19.56,38.23 v18.03,36.7
PB4
  Top 0.254: PWM1.1 10.79,52.32 13.02,54.55 15.75,54.55 19.3,50.99 21.72,50.99 22.35,50.35 22.35,39.5 22.73,39.12 26.67,39.12 29.02,36.77 30.72,36.77 IC1.23
PB5
  Top 0.254: IC1.24 28.68,36.28 26.35,38.61 21.4,38.61 20.83,39.18 20.83,40.45 20.7,40.58 18.8,40.58 18.29,41.08 18.29,42.55 17.78,43.05 16.19,43.05 15.68,42.55 15.68,40.39 14.73,39.43 9.72,39.43 9.27,39.88 9.27,46.04 8.76,46.55 PWM2.1
PB6
  Top 0.254: IC1.25 30.7,35.75 28.45,35.75 26.1,38.1 18.54,38.1 18.35,38.29 18.35,39.69 17.53,40.51 16.51,40.51 14.99,38.99 8.45,38.99 8,39.43 PWM3.1
PB7  (via drill 0.7)
  Top 0.254: 32.73,33.85 IC1.26 19.94,33.78 v18.92,32.77
  Bottom 0.254: PWM4.1 9.34,36.26 12.83,32.77 v18.92,32.77
PC6  (via drill 0.7)
  Top 0.254: v44.32,38.42 44.32,39.56 44.58,39.81 46.7,39.81 IC1.59 | v37.4,30.04 36.64,30.8 35.19,30.8 R24.1
  Bottom 0.254: v44.32,38.42 44.32,34.23 40.07,29.97 37.47,29.97 v37.4,30.04
PD0
  Top 0.254: IC1.43 41.21,33.76 41.21,27.24 58.42,10.03 I2C4.1 | I2C1.1 18.61,68.33 42.93,68.33 44.45,69.85 59.37,69.85 68.64,60.58 I2C3.1
  Bottom 0.254: I2C2.1 2.48,18.29 4.06,19.88 8.38,19.88 8.95,19.3 8.95,14.29 15.94,7.18 15.94,4.76 16.89,3.94 19.62,3.94 20.19,3.37 20.19,2.22 20.57,1.84 54.42,1.84 56.33,3.75 56.33,7.37 56.58,7.62 I2C4.1 60.33,7.62 65.79,13.08 65.79,51.18 68.64,54.04 I2C3.1
PD1
  Top 0.254: IC1.44 41.72,33.77 41.72,27.5 60.26,8.95 60.26,5.65 59.69,5.08 I2C4.2 | I2C1.2 18.41,71.06 19.3,71.06 21.53,68.83 42.61,68.83 44.13,70.36 55.37,70.36 55.69,70.67 55.69,72.2 55.88,72.39 59.63,72.39 60.01,72.01 60.01,70.23 71.18,59.05 I2C3.2
  Bottom 0.254: I2C2.2 5.02,17.53 15.3,6.99 15.3,2.48 16.7,1.33 54.67,1.33 I2C4.2 59.69,5.08 60.83,6.22 60.83,7.37 66.29,12.83 66.29,50.99 71.18,55.88 I2C3.2
PE
  Top 0.254: R2.1 45.78,14.92 U$1.2 41.02,14.92 39.81,16.13 | 39.81,16.13 U$1.5 39.81,19.37 39.41,19.77 R3.2 39.27,21.16 R4.2 | 39.81,16.13 38.61,14.92 U$1.10 U$1.11
PE0
  Top 0.254: IC1.2 30.71,47.31 28.89,47.31 28.51,47.69 28.51,55.55 R19.1
PE1  (via drill 0.7)
  Top 0.254: 42.13,58.04 IC4.5 39.9,58 v39.43,57.53 | v26.73,49.4 26.73,48.07 28,46.8 30.72,46.8 IC1.3
  Bottom 0.254: v39.43,57.53 39.43,50.35 38.67,49.59 26.92,49.59 v26.73,49.4
PH3  (via drill 0.7)
  Top 0.254: v13.91,34.99 15.24,33.66 15.24,17.72 17.91,15.05 PWM6.1 | IC1.15 30.69,40.83 29.46,40.83 26.54,43.75 v26.54,44.58
  Bottom 0.254: v13.91,34.99 24.64,34.99 26.54,36.89 v26.54,44.58
PH4
  Top 0.254: IC1.16 29.19,40.28 25.02,44.45 25.02,45.59 24.45,46.16 23.37,46.16 22.92,46.61 22.92,50.29 23.56,50.93 25.27,50.93 25.65,51.31 25.65,52.96 25.15,53.47 17.84,53.47 16,55.31 11.43,55.31 PWM5.1
PH5  (via drill 0.7)
  Top 0.254: IC1.17 35.59,39.78 36.07,40.26 36.07,45.4 35.81,45.66 34.8,45.66 31.37,49.09 31.37,50.74 31.88,51.24 37.53,51.24 v37.91,51.63
  Bottom 0.254: PWM7.1 46.42,68.58 45.34,67.5 45.34,61.15 43.24,59.05 38.92,59.05 37.91,58.04 v37.91,51.63
PH6
  Top 0.254: PWM8.1 62.74,17.78 41.21,39.31 30.76,39.31 IC1.18
RST  (via drill 0.7)
  Top 0.254: R5.1 C1.2 23.07,27.93 v24.77,26.42 | IC1.30 34.73,34.67 34.42,34.99 26.67,34.99 v26.61,34.92
  Bottom 0.254: v26.61,34.92 26.61,29.15 24.77,27.3 v24.77,26.42 24.89,26.29 28.32,26.29 29.84,27.81 29.84,42.35 30.48,42.99 38.16,42.99 39.56,41.59 S2.3
SCK/1.5
  Top 0.254: R30.2 R31.2 28.64,18.8 29.02,19.18 30.29,19.18 30.54,19.43 U$23.2
VCC  (via drill 0.7)
  Top 0.254: R1.2 47.94,10.29 51.63,6.6 51.63,4.74 LED1.A LED2.A LED3.A LED4.A LED5.A LED6.A LED7.A LED8.A LED9.A LED10.A 24.35,3.02 v24.32,3.05 | U1.3 21.21,29.17 | 21.21,29.17 21.73,29.17 R5.2 | R26.2 R16.2 24.41,58.29 U2.3 | R26.2 28.43,59.99 29.02,60.58 34.9,60.58 IC4.20 IC4.19 | 43.06,57.35 IC4.4 | 43.06,57.35 43.43,57.72 43.43,64.07 42.04,65.47 32.83,65.47 28.43,61.07 R26.2 | 21.21,29.17 20.89,28.85 20.89,26.8 21.14,26.54 23.43,26.54 23.69,26.29 23.69,25.65 24.07,25.27 28.7,25.27 29.91,26.48 29.91,32.38 30.23,32.7 35.05,32.7 35.23,32.89 IC1.31 35.23,34.81 v33.85,36.2 | IC1.80 42.73,54.16 43.43,54.86 | 43.43,54.86 43.43,56.98 43.06,57.35 | 50.86,47.43 JP22.1 52.59,47.43 C2.1 C6.1 | 50.86,47.43 50.42,46.99 50.42,41.34 49.85,40.77 46.75,40.77 IC1.61 | IC1.100 32.73,48.42 33.85,47.31 34.86,47.31 v35.24,46.93 | v33.02,45.34 33.02,43.69 32.64,43.31 30.76,43.31 IC1.10 | 50.86,47.43 43.43,54.86
  VCC 0.254: v24.32,3.05 24.26,3.05
  Bottom 0.254: v35.24,46.93 34.61,46.93 v33.02,45.34 | v33.85,36.2 33.85,36.64 34.61,37.4 34.61,39.62 34.99,40.01 49.72,40.01 50.93,41.21 54.99,41.21 55.31,41.53 55.31,46.86 54.74,47.43 JP22.1
  pour VCC: -0.64,77.09 77.34,77.09 77.34,-1.33 -0.64,-1.33
VCC_3V3  (via drill 0.7)
  Top 0.254: v23.75,52.2 U2.2
  Bottom 0.254: v23.75,52.2 23.75,48.9 24.57,48.07 45.4,48.07 46.1,47.37 46.1,43.81 46.67,43.24 JP20.1
VCC_5V
  Top 0.254: PWM5.2 5.71,52.45 PWM1.2 PWM2.2 5.59,41.4 PWM3.2 | PWM3.2 PWM4.2 | PWM3.2 5.46,39.69 6.6,38.54 16.26,38.54 J4.2 16.13,38.42 16.13,27.3 16.57,26.86 U1.2 16.64,26.86 16.13,26.35 16.13,17.53 18.41,15.24 18.41,9.97 20.38,8 20.38,6.1 19.62,5.33 PWM6.2
  Bottom 0.254: JP21.1 47.75,39.24 46.93,38.42 46.93,33.4 36.39,22.86 36.39,15.81 34.48,13.84 21.97,13.84 20.19,12.06 20.19,6.16 19.37,5.33 PWM6.2
VCC_12V
  Top 0.254: 53.28,35.18 JP19.1 56.52,35.18 H15.B2,8
WP
  Top 0.254: R25.1 33.73,29.81 U$23.5

### Text on the board
Reference: VCC | GND